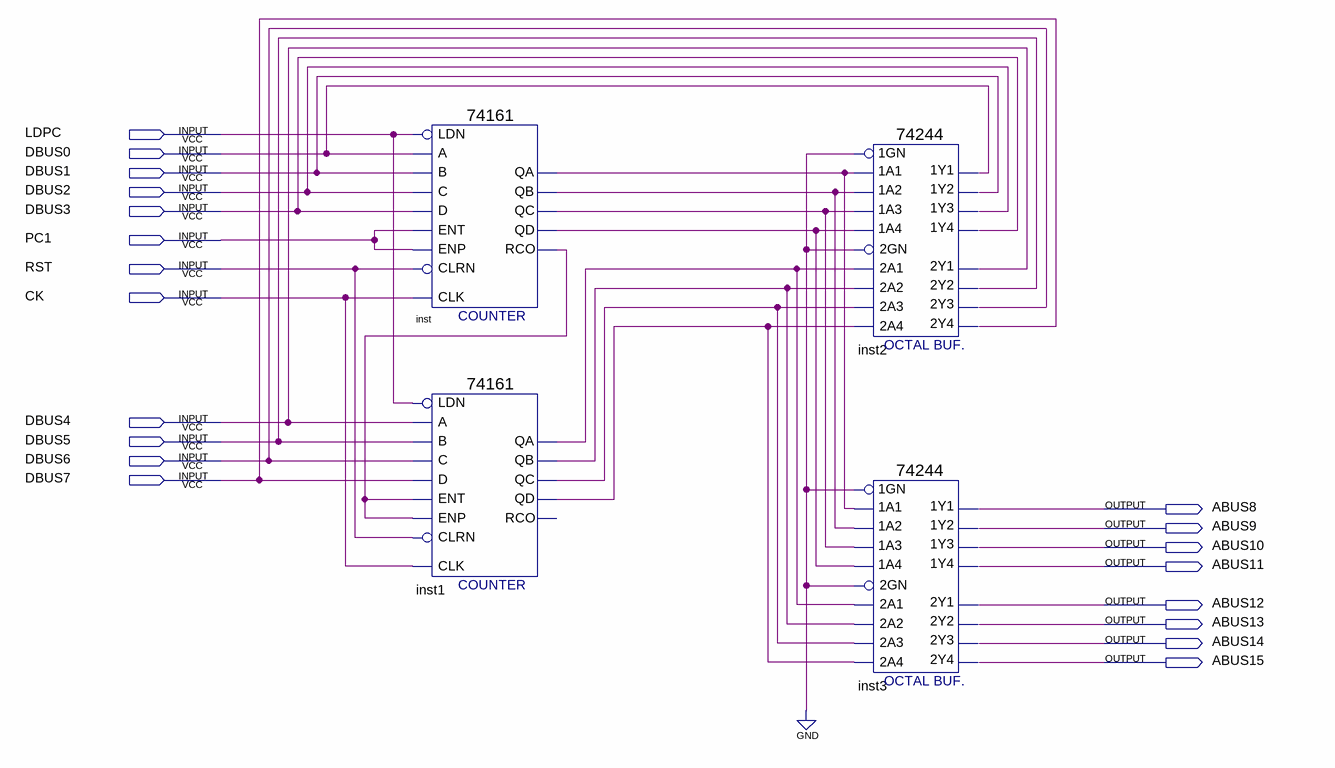
[diagram p0: schematic sheet]
// Quartus schematic Block1.bdf as structural Verilog: 4 symbols, 20 pins
module Block1 (
  input  LDPC,
  input  DBUS0,
  input  DBUS1,
  input  DBUS2,
  input  DBUS3,
  input  PC1,
  input  RST,
  input  CK,
  input  DBUS4,
  input  DBUS5,
  input  DBUS6,
  input  DBUS7,
  output ABUS8,
  output ABUS9,
  output ABUS10,
  output ABUS11,
  output ABUS12,
  output ABUS13,
  output ABUS14,
  output ABUS15
);

  wire inst1_qa, inst1_qb, inst1_qc, inst1_qd, inst_qa, inst_qb, inst_qc, inst_qd, inst_rco;

  \74161  inst (
    .CLRN(RST), .CLK(CK), .ENP(PC1), .LDN(LDPC), .A(DBUS0), .D(DBUS3), .ENT(PC1), .B(DBUS1), .C(DBUS2),
    .QD(inst_qd), .QC(inst_qc), .QB(inst_qb), .QA(inst_qa), .RCO(inst_rco));
  \74161  inst1 (
    .CLRN(RST), .CLK(CK), .ENP(inst_rco), .LDN(LDPC), .A(DBUS4), .D(DBUS7), .ENT(inst_rco), .B(DBUS5),
    .C(DBUS6), .QD(inst1_qd), .QC(inst1_qc), .QB(inst1_qb), .QA(inst1_qa));  // open: RCO
  \74244  inst2 (
    .\1A2 (inst_qb), .\1A4 (inst_qd), .\1A1 (inst_qa), .\1A3 (inst_qc), .\1GN (1'b0), .\2A3 (inst1_qc),
    .\2GN (1'b0), .\2A1 (inst1_qa), .\2A4 (inst1_qd), .\2A2 (inst1_qb), .\1Y2 (DBUS1), .\1Y4 (DBUS3),
    .\2Y1 (DBUS4), .\1Y1 (DBUS0), .\2Y3 (DBUS6), .\2Y4 (DBUS7), .\1Y3 (DBUS2), .\2Y2 (DBUS5));
  \74244  inst3 (
    .\1A2 (inst_qb), .\1A4 (inst_qd), .\1A1 (inst_qa), .\1A3 (inst_qc), .\1GN (1'b0), .\2A3 (inst1_qc),
    .\2GN (1'b0), .\2A1 (inst1_qa), .\2A4 (inst1_qd), .\2A2 (inst1_qb), .\1Y2 (ABUS9), .\1Y4 (ABUS11),
    .\2Y1 (ABUS12), .\1Y1 (ABUS8), .\2Y3 (ABUS14), .\2Y4 (ABUS15), .\1Y3 (ABUS10), .\2Y2 (ABUS13));
endmodule
